# Altium schematic sheet partes_proyecto.SchDoc
size B; SheetNumber: 1; SheetTotal: 1
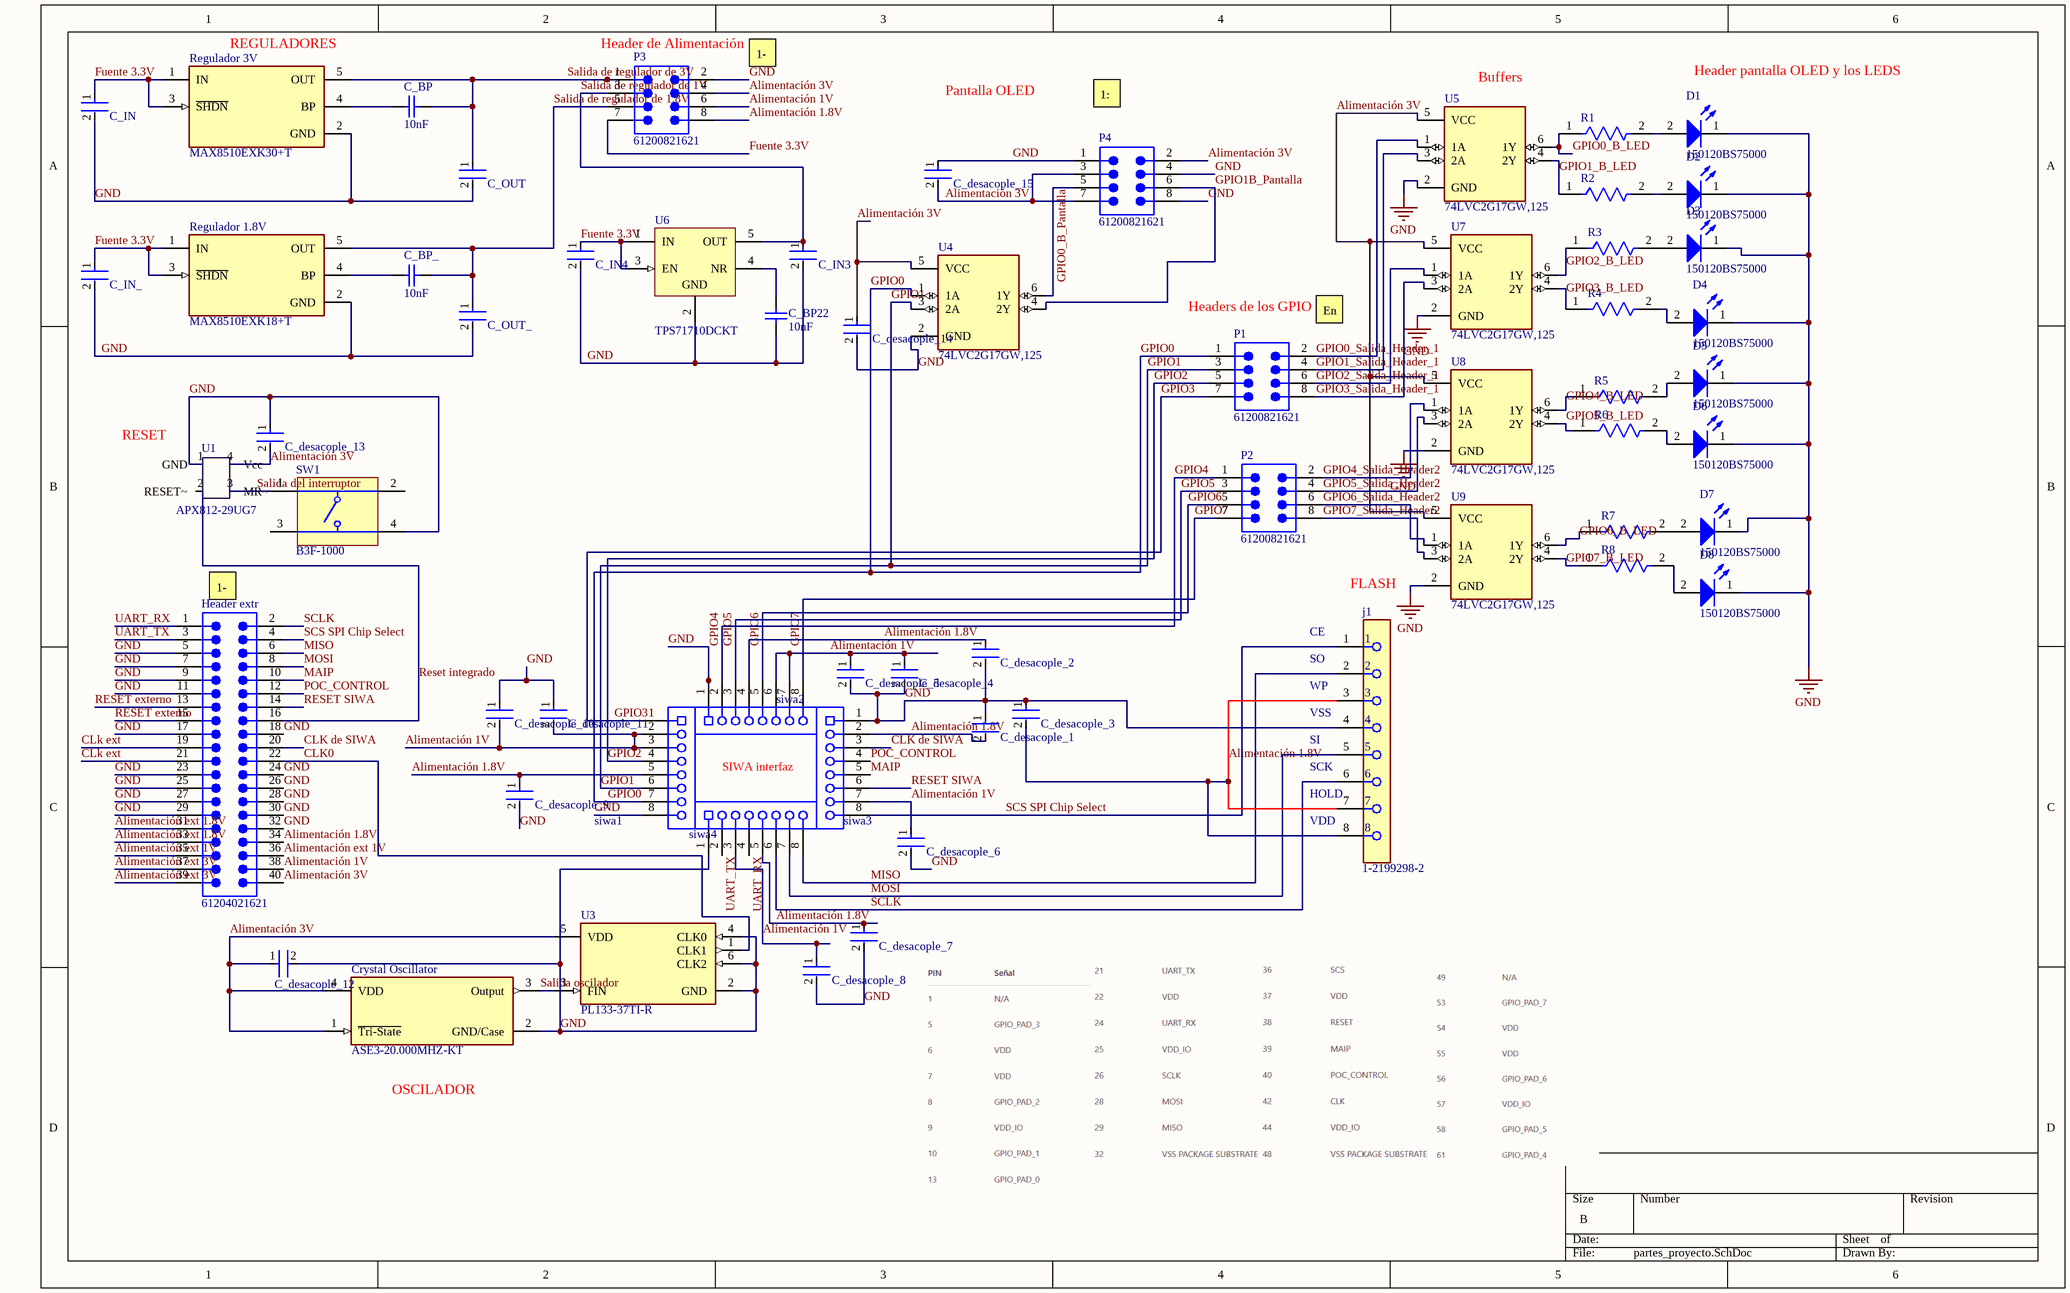
[diagram p0: partes_proyecto.SchDoc]

## Parts
C_BP  10nF  [CAPC2013X100X50NL20T25]
C_BP22  10nF  [CAPC2013X100X50NL20T25]
C_BP_  10nF  [CAPC2013X100X50NL20T25]
C_desacople_1  CC0603KRX7R7BB104  [FP-CC0603-DA-MFG]  (value not drawn)
C_desacople_2  CC0603KRX7R7BB104  [FP-CC0603-DA-MFG]  (value not drawn)
C_desacople_3  CC0603KRX7R7BB104  [FP-CC0603-DA-MFG]  (value not drawn)
C_desacople_4  CC0603KRX7R7BB104  [FP-CC0603-DA-MFG]  (value not drawn)
C_desacople_5  CC0603KRX7R7BB104  [FP-CC0603-DA-MFG]  (value not drawn)
C_desacople_6  CC0603KRX7R7BB104  [FP-CC0603-DA-MFG]  (value not drawn)
C_desacople_7  CC0603KRX7R7BB104  [FP-CC0603-DA-MFG]  (value not drawn)
C_desacople_8  CC0603KRX7R7BB104  [FP-CC0603-DA-MFG]  (value not drawn)
C_desacople_9  CC0603KRX7R7BB104  [FP-CC0603-DA-MFG]  (value not drawn)
C_desacople_10  CC0603KRX7R7BB104  [FP-CC0603-DA-MFG]  (value not drawn)
C_desacople_11  CC0603KRX7R7BB104  [FP-CC0603-DA-MFG]  (value not drawn)
C_desacople_12  CC0603KRX7R7BB104  [FP-CC0603-DA-MFG]  (value not drawn)
C_desacople_13  CC0603KRX7R7BB104  [FP-CC0603-DA-MFG]  (value not drawn)
C_desacople_14  CC0603KRX7R7BB104  [FP-CC0603-DA-MFG]  (value not drawn)
C_desacople_15  CC0603KRX7R7BB104  [FP-CC0603-DA-MFG]  (value not drawn)
C_IN  CC0603KRX7R7BB104  [FP-CC0603-DA-MFG]  (value not drawn)
C_IN3  CC0603KRX7R7BB104  [FP-CC0603-DA-MFG]  (value not drawn)
C_IN4  CC0603KRX7R7BB104  [FP-CC0603-DA-MFG]  (value not drawn)
C_IN_  CC0603KRX7R7BB104  [FP-CC0603-DA-MFG]  (value not drawn)
C_OUT  CC0603KRX7R7BB104  [FP-CC0603-DA-MFG]  (value not drawn)
C_OUT_  CC0603KRX7R7BB104  [FP-CC0603-DA-MFG]  (value not drawn)
Crystal_Oscillator  ASE3-20.000MHZ-KT  [FP-ASE3-MFG]
D1  150120BS75000  [WL-SMCW_1206_150120xx75000]
D2  150120BS75000  [WL-SMCW_1206_150120xx75000]
D3  150120BS75000  [WL-SMCW_1206_150120xx75000]
D4  150120BS75000  [WL-SMCW_1206_150120xx75000]
D5  150120BS75000  [WL-SMCW_1206_150120xx75000]
D6  150120BS75000  [WL-SMCW_1206_150120xx75000]
D7  150120BS75000  [WL-SMCW_1206_150120xx75000]
D8  150120BS75000  [WL-SMCW_1206_150120xx75000]
Header_extr  61204021621  [61204021621]
j1  1-2199298-2  [FP-1-2199298-2-MFG]
P1  61200821621  [61200821621]
P2  61200821621  [61200821621]
P3  61200821621  [61200821621]
P4  61200821621  [61200821621]
R1  10  [FP-MCT0603-IPC_A]  (value not drawn)
R2  10  [FP-MCT0603-IPC_A]  (value not drawn)
R3  10  [FP-MCT0603-IPC_A]  (value not drawn)
R4  10  [FP-MCT0603-IPC_A]  (value not drawn)
R5  10  [FP-MCT0603-IPC_A]  (value not drawn)
R6  10  [FP-MCT0603-IPC_A]  (value not drawn)
R7  10  [FP-MCT0603-IPC_A]  (value not drawn)
R8  10  [FP-MCT0603-IPC_A]  (value not drawn)
Regulador_1.8V  MAX8510EXK18+T  [FP-X5-1-MFG]
Regulador_3V  MAX8510EXK30+T  [FP-X5-1-MFG]
siwa1  PPPC081LFBN-RC  [SLIN-PPPC081LFBN-RC_V]  (value not drawn)
siwa2  PPPC081LFBN-RC  [SLIN-PPPC081LFBN-RC_V]  (value not drawn)
siwa3  PPPC081LFBN-RC  [SLIN-PPPC081LFBN-RC_V]  (value not drawn)
siwa4  PPPC081LFBN-RC  [SLIN-PPPC081LFBN-RC_V]  (value not drawn)
SW1  B3F-1000  [OMRON-B3F-1000-4_V]
U1  APX812-29UG7  [APX812-29UG7]
U3  PL133-37TI-R  [FP-SOT23-6LD-PL-1-IPC_A]
U4  74LVC2G17GW,125  [SOT363_INFINEON]
U5  74LVC2G17GW,125  [SOT363_INFINEON]
U6  TPS71710DCKT  [DCK0005A_M]
U7  74LVC2G17GW,125  [SOT363_INFINEON]
U8  74LVC2G17GW,125  [SOT363_INFINEON]
U9  74LVC2G17GW,125  [SOT363_INFINEON]

## Nets
GND: C_BP22.1 C_desacople_1.1 C_desacople_2.2 C_desacople_3.1 C_desacople_4.2 C_desacople_5.2 C_desacople_6.2 C_desacople_7.2 C_desacople_8.2 C_desacople_9.2 C_desacople_10.1 C_desacople_11.1 C_desacople_12.2 C_desacople_13.1 C_desacople_14.2 C_desacople_15.1 C_IN.2 C_IN3.2 C_IN4.2 C_IN_.2 C_OUT.2 C_OUT_.2 Crystal_Oscillator.2(GND/Case) D1.1(K) D2.1(K) D3.1(K) D4.1(K) D5.1(K) D6.1(K) D7.1(K) D8.1(K) Header_extr.5 Header_extr.7 Header_extr.9 Header_extr.11 Header_extr.17 Header_extr.18 Header_extr.23 Header_extr.24 Header_extr.25 Header_extr.26 Header_extr.27 Header_extr.28 Header_extr.29 Header_extr.30 Header_extr.32 j1.4 P3.2 P4.1 P4.4 P4.8 Regulador_1.8V.2(GND) Regulador_3V.2(GND) siwa1.8 siwa2.1 siwa3.1 siwa4.1 SW1.4 U1.1(GND) U3.2(GND) U3.4(CLK0) U3.6(CLK2) U4.2(GND) U5.2(GND) U6.2(GND) U7.2(GND) U8.2(GND) U9.2(GND)
Alimentación 1.8V: C_desacople_1.2 C_desacople_2.1 C_desacople_3.2 C_desacople_7.1 C_desacople_9.1 Header_extr.34 j1.3 j1.7 j1.8 P3.8 siwa1.5 siwa2.4 siwa3.2 siwa4.5
Alimentación 1V: C_desacople_4.1 C_desacople_5.1 C_desacople_6.1 C_desacople_8.1 C_desacople_10.2 C_desacople_11.2 Header_extr.38 P3.6 siwa1.2 siwa1.3 siwa2.6 siwa2.7 siwa3.7 siwa4.3
Alimentación 3V: C_desacople_12.1 C_desacople_13.2 C_desacople_14.1 C_desacople_15.2 Crystal_Oscillator.1(~{Tri-State}) Crystal_Oscillator.4(VDD) Header_extr.40 P3.4 P4.2 P4.3 P4.7 U1.4(Vcc) U3.5(VDD) U4.5(VCC) U5.5(VCC) U7.5(VCC) U8.5(VCC) U9.5(VCC)
Alimentación ext 1.8V: Header_extr.31 Header_extr.33
Alimentación ext 1V: Header_extr.35 Header_extr.36
Alimentación ext 3V: Header_extr.37 Header_extr.39
CLK0: Header_extr.22 U3.1(CLK1)
CLK de SIWA: Header_extr.20 siwa3.3
CLk ext: Header_extr.19 Header_extr.21
Fuente 3.3V: C_IN.1 C_IN4.1 C_IN_.1 P3.7 Regulador_1.8V.1(IN) Regulador_1.8V.3(~{SHDN}) Regulador_3V.1(IN) Regulador_3V.3(~{SHDN}) U6.1(IN) U6.3(EN)
GPIO0: P1.1 siwa1.7 U4.1(1A)
GPIO0_B_LED: R1.1 U5.6(1Y)
GPIO0_B_Pantalla: P4.5 U4.6(1Y)
GPIO0_Salida_Header_1: P1.2 U5.1(1A)
GPIO1: P1.3 siwa1.6 U4.3(2A)
GPIO1_B_LED: R2.1 U5.4(2Y)
GPIO1_Salida_Header_1: P1.4 U5.3(2A)
GPIO1B_Pantalla: P4.6 U4.4(2Y)
GPIO2: P1.5 siwa1.4
GPIO2_B_LED: R3.1 U7.6(1Y)
GPIO2_Salida_Header_1: P1.6 U7.1(1A)
GPIO3: P1.7 siwa1.1
GPIO3_B_LED: R4.1 U7.4(2Y)
GPIO3_Salida_Header_1: P1.8 U7.3(2A)
GPIO4: P2.1 siwa2.2
GPIO4_B_LED: R5.1 U8.6(1Y)
GPIO4_Salida_Header2: P2.2 U8.1(1A)
GPIO5: P2.3 siwa2.3
GPIO5_B_LED: R6.1 U8.4(2Y)
GPIO5_Salida_Header2: P2.4 U8.3(2A)
GPIO6: P2.5 siwa2.5
GPIO6_B_LED: R7.1 U9.6(1Y)
GPIO6_Salida_Header2: P2.6 U9.1(1A)
GPIO7: P2.7 siwa2.8
GPIO7_B_LED: R8.1 U9.4(2Y)
GPIO7_Salida_Header2: P2.8 U9.3(2A)
MAIP: Header_extr.10 siwa3.5
MISO: Header_extr.6 j1.2 siwa4.8
MOSI: Header_extr.8 j1.5 siwa4.7
POC_CONTROL: Header_extr.12 siwa3.4
RESET externo: Header_extr.13 Header_extr.15
Reset integrado: Header_extr.16 U1.2(RESET~)
RESET SIWA: Header_extr.14 siwa3.6
Salida de regulador de 1.8V: C_BP_.2 C_OUT_.1 P3.5 Regulador_1.8V.5(OUT)
Salida de regulador de 1V: C_IN3.1 P3.3 U6.5(OUT)
Salida de regulador de 3V: C_BP.2 C_OUT.1 P3.1 Regulador_3V.5(OUT)
Salida del interruptor: SW1.1 U1.3(MR~)
Salida oscilador: Crystal_Oscillator.3(Output) U3.3(FIN)
SCLK: Header_extr.2 j1.6 siwa4.6
SCS SPI Chip Select: Header_extr.4 j1.1 siwa3.8
UART_RX: Header_extr.1 siwa4.4
UART_TX: Header_extr.3 siwa4.2
NetC_BP22_2: C_BP22.2 U6.4(NR)
NetC_BP_1: C_BP.1 Regulador_3V.4(BP)
NetC_BP__1: C_BP_.1 Regulador_1.8V.4(BP)
NetD1_2: D1.2(A) R1.2
NetD2_2: D2.2(A) R2.2
NetD3_2: D3.2(A) R3.2
NetD4_2: D4.2(A) R4.2
NetD5_2: D5.2(A) R5.2
NetD6_2: D6.2(A) R6.2
NetD7_2: D7.2(A) R7.2
NetD8_2: D8.2(A) R8.2

Not connected (* = marked no-connect by the designer): SW1 2 3

## Notes on the sheet
- (near Regulador_3V) REGULADORES
- (near P3) Header de Alimentación
- 1- Regulador de 3V
  3- Regulador de 1V
  5- Regulador de 1.8V
  7- Salida de 1V
  2- Salida de 3V
  4- Entrada de los reguladores
  6- Fuente externa de 3.3V
  8- Salida de 1.8V
- Pantalla OLED
- 1: GND
  2: VDD_SEL
  3: VDDIO
  4: SA0
  5: SCL
  6: SDA
  7: /RES
  8: NC
- (near U5) Buffers
- Header pantalla OLED y los LEDS
- (near P1) Headers de los GPIO
- (near P1) En P1:
  Entradas 1, 3, 5 y 7 reciben los GPIO [0-3]
  En P2:
  Entradas 1, 3, 5 y 7 reciben los GPIO [4-7]
- (near U1) RESET
- (near Header_extr) 1-
  3- Tierra externa
  5- Reset generado con pulsador en la PCB
  7- Reset externo
  9- Alimentación regulada de 3V
  11- Alimentación regulada de 1.8V
  13- Alimentación regulada de 1V
  2- Alimentación que va a reguladores
  4- Tierra que va a reguladores
  6- Salida del Reset que va a SIWA
  8-
- (near j1) CE
- FLASH
- (near j1) SO
- (near j1) WP
- SIWA interfaz
- (near j1) VSS
- (near j1) SI
- (near j1) SCK
- (near j1) HOLD
- (near j1) VDD
- (near Crystal_Oscillator) OSCILADOR

## Library data of the parts
C_BP C_BP22 C_BP_ = CMP-2007-03708-1: Part Number: C0805F103K5RACTU; Manufacturer: Kemet
C_desacople_1-C_desacople_15 C_IN C_IN3 C_IN4 C_IN_ C_OUT C_OUT_ = CMP-2000-05002-2: CAP CER 0.1UF 16V X7R 0603; Manufacturer: YAGEO; Tolerance: 0.1; Value: 100 nF; Temperature Coefficient: 15%; Voltage Rating: 16 V; Package: CC0603-DA; ComponentLink2Description: Datasheet; Octopart: https://octopart.com/cc0603krx7r7bb104-yageo-192941; Temperature Range High: +125°C; Digikey Description: CAP CER 0.1UF 16V X7R 0603; Voltage: 16 V; Device Class L2: Capacitors; Height: 0.9mm; Temperature: -55°C to +125°C; Manufacturer Part Number: CC0603KRX7R7BB104; Device Class L1: Passive Components; Device Class L3: Ceramic Capacitors; ComponentLink2URL: http://www.yageo.com/documents/recent/UPY-GPHC_X7R_6.3V-to-50V_18.pdf; Footprint Url: http://www.yageo.com/exep/pages/download/literatures/UPY-C_GEN_24.pdf; RoHS: TRUE; Temperature Range Low: -55°C; Temperature Characteristic: X7R; Lead Free: Yes; Capacitance: 100 nF; Category: Cap; Mouser Description: Multilayer Ceramic Capacitor, CC Series, 0.1 - F, - 10%, X7R, 16 V, 0603 [1608 Metric]; Material: Ceramic; Automotive: No
Crystal_Oscillator = CMP-27762-010045-1: XTAL OSC XO 20.0000MHZ CMOS SMD; Min Supply Voltage: 1.71V; Max Supply Current: 4mA; Operating Supply Voltage: 1.8V; Max Supply Voltage: 1.89V; Frequency: 20MHz; Frequency Stability: 30ppm; Load Capacitance: 15pF; Length: 3.2mm; Mount: Surface Mount; Min Operating Temperature: -10°C; Max Operating Temperature: 70°C; Series: ASE3; Height: 0.049inch; Package Quantity: 1000; Depth: 2.5mm; Case/Package: SMD/SMT; Number of Pins: 4; Lead Free: Lead Free; Width: 0.098inch; Termination: SMD/SMT; Packaging: Tape and Reel; Radiation Hardening: No
D1-D8 = CMP-1426-00015-3: WL-SMCW SMT Mono-Color Chip LED Waterclear; Manufacturer Package Identifier: LED_1206; Dominant Wavelength: 470nm; Lens Style: Clear, Rectangular; Test Current: 20mA; Forward Voltage: 3.2V; Forward Current: 100mA; Peak Wavelength: 465nm; Max Reverse Voltage (DC): 5V; Viewing Angle: 140°; Color: Blue; Luminous Intensity: 145mcd; Max Operating Temperature: 85°C; Case Code (Imperial): 1206; Length: 3.2mm; Width: 1.6mm; Min Operating Temperature: -40°C; Height: 680µm; Case Code (Metric): 3216; Packaging: Tape and Reel; RoHS: Compliant; Case/Package: 1206; REACH SVHC: Unknown; Wavelength: 470nm; Mount: Surface Mount
Header_extr = CMP-1502-00015-3: NexarPartId: 25903616; Gender: Male; Row Spacing: 2.54mm; Connector Type: Male Pin; Current Rating: 3A; Number of Positions: 40; Voltage Rating: 250V; Insulation Resistance: 1GΩ; Contact Resistance: 20mΩ; RoHS: Compliant; Color: Black; Pitch: 2.54mm; Orientation: Vertical; Contact Plating: Gold; Lead Pitch: 2.54mm; REACH SVHC: Unknown; Termination: Solder; Max Operating Temperature: 105°C; Insulation Material: PBT; Number of Rows: 2; Min Operating Temperature: -40°C; Number of Pins: 40; Mount: Through Hole; Contact Material: Copper; Number of Contacts: 40; Height: 9.25mm; Length: 58.46mm; Operating Supply Voltage: 250V
j1 = CMP-03370-000009-1: CONN IC DIP SOCKET 8POS TIN; Contact Post Length: 3inch; Number of Contacts: 8; Contact Current Rating: 1A; Contact Resistance: 20mR; Insulation Resistance: 1GR; Connector Type: Pin; Row Spacing: 0.3inch; Pitch: 2.54mm; Mating Alignment: Yes (With); RoHS Compliant: Yes; Packaging: Rail/Tube; Contact Material: Bronze; Lead Pitch: 2.54mm; Mount: Through Hole; Termination: Through Hole; Max Operating Temperature: 105°C; Flammability Rating: UL94 V-0; Package Quantity: 60; Contact Finish - Mating: TIN; ELV: Compliant; Radiation Hardening: No; Number of Rows: 2; Series: Diplomate DL; Color: Black; Number of Positions: 8; Contact Plating: Tin; Min Operating Temperature: -40°C; Lead Free: Lead Free; Length: 0.4inch; Orientation: Straight; Housing Material: PBT
P1-P4 = CMP-1502-00006-2: NexarPartId: 32855460; Gender: Male; Row Spacing: 2.54mm; Connector Type: Male Pin; Insulation Resistance: 1GΩ; Contact Resistance: 20mΩ; Number of Positions: 8; Current Rating: 3A; Operating Supply Voltage: 250V; Orientation: Vertical; Lead Pitch: 2.54mm; Length: 17.82mm; Max Operating Temperature: 105°C; Mount: Through Hole; Color: Black; Insulation Material: PBT; RoHS: Compliant; Contact Material: Copper; Number of Contacts: 8; Pitch: 2.54mm; Contact Plating: Gold; Min Operating Temperature: -40°C; Number of Pins: 8; Termination: Solder; REACH SVHC: Unknown; Number of Rows: 2
R1-R8 = CMP-02407-011165-1: RES SMD 100 OHM 1% 1/8W 0603; Temperature Coefficient: 25ppm/°C; Resistance: 20kR; Power Rating: 125mW; Tolerance: 0.1%; Voltage Rating: 75V; Length: 1.55mm; Case Code (Imperial): 0603; Case/Package: 0603; Construction: Rectangular; Package Quantity: 1000; Number of Terminations: 2; Termination: SMD/SMT; Resistor Type: Thin Film; Features: Automotive AEC-Q200; Series: MCT 0603 - Precision; Max Operating Temperature: 155°C; Depth: 0.85mm; Max Power Dissipation: 125mW; Min Operating Temperature: -55°C; Width: 0.033inch; Case Code (Metric): 1608; Packaging: Tape and Reel; Weight: 6.7E-05oz; Military Standard: Not; Height: 0.022inch
Regulador_1.8V = CMP-0246-00401-2: IC REG LINEAR 1.8V 120MA SC70-5; Accuracy: 2%; Number of Outputs: 1; Min Current Limit: 130mA; Max Input Voltage: 6V; Max Power Dissipation: 247mW; Output Configuration: Positive; Output Type: Fixed; Quiescent Current: 90uA; Reference Voltage: 1.225V; Min Input Voltage: 2V; Power Supply Rejection Ratio (PSRR): 54dB; Input Bias Current: 40uA; Output Current: 120mA; Nominal Output Voltage: 1.8V; Output Voltage: 1.8V; Series: -; Number of Regulators: 1; Packaging: Tape and Reel; Mount: Surface Mount; Case/Package: SC; Lead Free: Lead Free; RoHS Compliant: Yes; Number of Pins: 5; Package Quantity: 2500; Max Output Current: 120mA; Polarity: Positive; Min Operating Temperature: -40°C; Max Operating Temperature: 85°C
Regulador_3V = CMP-0246-00520-2: IC REG LINEAR 3V 120MA SC70-5; Output Configuration: Positive; Dropout Voltage: 120mV; Min Current Limit: 130mA; Number of Outputs: 1; Max Input Voltage: 6V; Power Supply Rejection Ratio (PSRR): 54dB; Reference Voltage: 1.225V; Min Input Voltage: 2V; Max Power Dissipation: 247mW; Accuracy: 2%; Input Bias Current: 40uA; Output Type: Fixed; Quiescent Current: 90uA; Output Current: 120mA; Nominal Output Voltage: 3V; Max Output Current: 120mA; Package Quantity: 2500; Polarity: Positive; Number of Pins: 5; RoHS Compliant: Yes; Output Voltage: 3V; Mount: Surface Mount; Lead Free: Lead Free; Case/Package: SC; Number of Regulators: 1; Packaging: Tape and Reel; Series: -; Min Operating Temperature: -40°C; Radiation Hardening: No; Max Operating Temperature: 85°C
siwa1-siwa4 = CMP-1770-00002-1: Female Header, Pitch 2.54 mm, 1 x 8 Position, Height 8.5 mm, Tail Length 3.2 mm, -40 to 105 degC, RoHS, Bulk; Case\Package: TO-252-3; Rds On Max: 115 mohm; Typical Rise Time: 90 ns; Max Power Dissipation: 2.5 W; Input Capacitance: 350 pF; Elements: 1; Height: 2.39 mm; Min Operating Temperature: -55 degC; RoHSCompliant: true; PackageDescription: Female Header, Pitch 2.54 mm, 1 x 8 Position, Height 8.5 mm, Tail Length 3.2 mm; Length: 6.73 mm; ComponentLink1Description: Datasheet; Package Quantity: 2500; Max Operating Temperature: 150 degC; Width: 6.22 mm; Radiation Hardening: No; Packaging: Tape and Reel; REACH SVHC: No SVHC; Pins: 3; PackageReference: PPPC081LFBN-RC; ComponentLink1URL: http://sullinscorp.com/catalogs/101_PAGE114-115_.100_FEMALE_HDR.pdf; DatasheetVersion: Jan-15; Mount: Surface Mount
SW1 = CMP-1677-00002-1: Tactile Switch, SPST-NO, 0.05 A, 5 to 24 V, -25 to 70 degC, 4-Pin THD, RoHS, Bulk; Shielding: Shielded; Gender: Female; Capacitance: -45 f; Voltage Rating: 150 V; Current Rating: 1.5 A; Radiation Hardening: No; Contact Plating: Gold; Height: 14.99 mm; Min Operating Temperature: -40 degC; Packaging: Tray; ComponentLink2Description: Datasheet; ComponentLink1URL: http://www.omron.com/; Lead Pitch: 1.27 mm; RoHSCompliant: true; Pins: 8; PackageReference: B3F-1000; Width: 25.4 mm; Contact Material: Brass; ComponentLink2URL: http://www.omron.com/ecb/products/pdf/en-b3f.pdf; PackageDescription: 4-Pin Through Hole Device, Body 6 x 6 mm; DatasheetVersion: Jan-15; ComponentLink1Description: Manufacturer URL; Package Quantity: 1080; Mount: Through Hole; Length: 18.34 mm; Max Operating Temperature: 70 degC
U1 = APX812-29UG7: 4-Pin Microprocessor Supervisor With Manual Reset. SOT143.
U3 = CMP-06262-000018-1: IC CLK BUFFER 1:3 150MHZ 6SOT23; Number of Circuits: 1; Input: LVCMOS; Lead Free: Lead Free; Case/Package: SOT-23-6; Min Operating Temperature: -40°C; Max Frequency: 150MHz; Series: -; RoHS Compliant: Yes; Max Operating Temperature: 85°C; Package Quantity: 3000; Mount: Surface Mount; Packaging: Cut Tape
U6 = CMP-0394-00843-2: Single Output High PSRR LDO, 150 mA, Fixed 1 V Output, 2.5 to 6.5 V Input, with Low IQ, 5-pin SC70 (DCK), -40 to 85 degC, Green (RoHS & no Sb/Br); Manufacturer: Texas Instruments; Fixed Output Options(V): 1; Iq(Typ)(mA): 0.05; Vdo(Typ)(mV): 170; Vin(Min)(V): 2.5; Vin(Max)(V): 6.5; Iout(Max)(A): 0.15; Accuracy(%): 3; SubFamily: Single Channel LDO; Rule: UNIONINDEX=0|RULEKIND=Clearance|NETSCOPE=DifferentNets|LAYERKIND=SameLayer|NAME=Schematic Clearance Constraint|GAP=7.874mil|GENERICCLEARANCE=7.874mil|IGNOREPADTOPADCLEARANCEINFOOTPRINT=TRUE|OBJECTCLEARANCES= |UNIT=Metric; PackageReference: DCK0005A; Mounting Technology: Surface Mount; Vout Adj(Max)(V): 1; Eco-Plan: Green (RoHS & no Sb/Br); Vout Adj(Min)(V): 1; ComponentLink1URL: http://www.ti.com/; ComponentLink1Description: Manufacturer URL; ComponentLink2URL: http://www.ti.com/general/docs/lit/getliterature.tsp?genericPartNumber=TPS71710&fileType=pdf; ComponentLink3Description: Package Specification; ComponentLink3URL: http://www.ti.com/litv/pdf/mpds025f; Code_JEDEC: MO-203; DatasheetVersion: SBVS068G; ComponentLink2Description: Datasheet; PackageVersion: 4093553-3/G; PackageDescription: 5-Pin Plastic Small-Outline, Body 2 x 1.25 mm, Pitch 0.65 mm; PartNumber: TPS71710DCKT